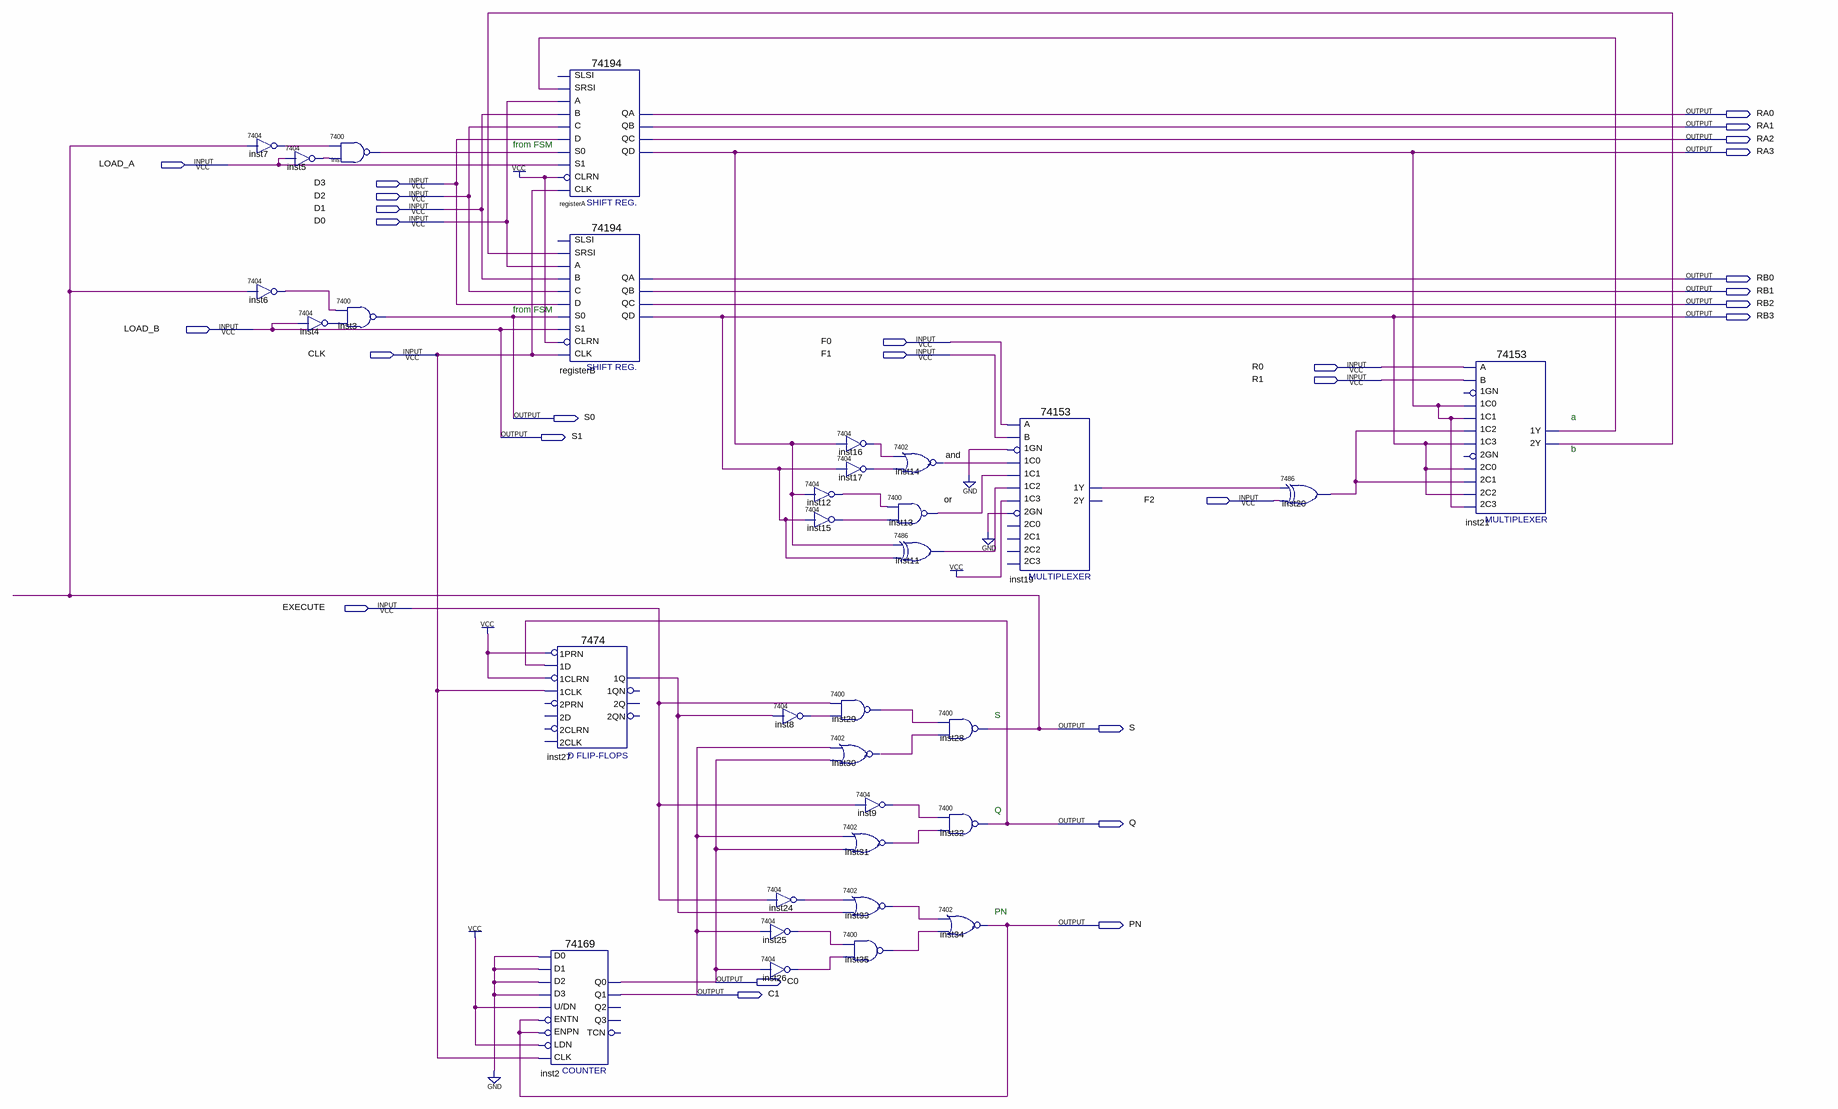
[diagram p0: schematic sheet]
// Quartus schematic lab3.bdf as structural Verilog: 33 symbols, 28 pins
module lab3 (
  input  LOAD_A,
  input  D3,
  input  D2,
  input  D1,
  input  D0,
  input  LOAD_B,
  input  F0,
  input  CLK,
  input  F1,
  input  R0,
  input  R1,
  input  F2,
  input  EXECUTE,
  output RA0,
  output RA1,
  output RA2,
  output RA3,
  output RB0,
  output RB1,
  output RB2,
  output RB3,
  output S0,
  output S1,
  output S,
  output Q,
  output PN,
  output C0,
  output C1
);

  wire \and , inst4_1, inst5_1, inst6_1, inst7_1, inst8_1, inst9_1, inst11_1, inst12_1, inst15_1, inst16_1,
       inst17_1, inst19_1y, inst20_1, inst21_1y, inst21_2y, inst24_1, inst25_1, inst26_1, inst27_1q,
       inst29_1, inst30_1, inst31_1, inst33_1, inst35_1, inst_1, \or ;

  \7404  inst7 (.\2 (S), .\1 (inst7_1));
  \7404  inst6 (.\2 (S), .\1 (inst6_1));
  \7404  inst5 (.\2 (LOAD_A), .\1 (inst5_1));
  \7404  inst4 (.\2 (LOAD_B), .\1 (inst4_1));
  \7400  inst (.\3 (inst5_1), .\2 (inst7_1), .\1 (inst_1));
  \7400  inst3 (.\3 (inst4_1), .\2 (inst6_1), .\1 (S0));
  \74194  registerA (
    .SRSI(inst21_1y), .B(D1), .C(D2), .CLK(CLK), .CLRN(1'b1), .D(D3), .S1(LOAD_A), .S0(inst_1), .A(D0),
    .QA(RA0), .QB(RA1), .QC(RA2), .QD(RA3));  // open: SLSI
  \74194  registerB (
    .SRSI(inst21_2y), .B(D1), .C(D2), .CLK(CLK), .CLRN(1'b1), .D(D3), .S1(LOAD_B), .S0(S0), .A(D0), .QA(RB0),
    .QB(RB1), .QC(RB2), .QD(RB3));  // open: SLSI
  \7474  inst27 (
    .\1CLK (CLK), .\1D (Q), .\1PRN (1'b1), .\1CLRN (1'b1), .\1Q (inst27_1q));  // open: 2D, 2PRN, 2CLK, 2CLRN, 1QN, 2Q, 2QN
  \74169  inst2 (
    .D1(1'b0), .D2(1'b0), .D0(1'b0), .ENTN(PN), .\U/DN (1'b1), .D3(1'b0), .LDN(1'b1), .CLK(CLK), .ENPN(PN),
    .Q1(C1), .Q0(C0));  // open: Q2, TCN, Q3
  \7404  inst24 (.\2 (EXECUTE), .\1 (inst24_1));
  \7404  inst25 (.\2 (C1), .\1 (inst25_1));
  \7404  inst26 (.\2 (C0), .\1 (inst26_1));
  \7404  inst12 (.\2 (RA3), .\1 (inst12_1));
  \7404  inst15 (.\2 (RB3), .\1 (inst15_1));
  \7404  inst8 (.\2 (inst27_1q), .\1 (inst8_1));
  \7404  inst16 (.\2 (RA3), .\1 (inst16_1));
  \7404  inst17 (.\2 (RB3), .\1 (inst17_1));
  \7400  inst29 (.\3 (inst8_1), .\2 (EXECUTE), .\1 (inst29_1));
  \7402  inst30 (.\2 (C1), .\3 (C0), .\1 (inst30_1));
  \7404  inst9 (.\2 (EXECUTE), .\1 (inst9_1));
  \7402  inst31 (.\2 (C1), .\3 (C0), .\1 (inst31_1));
  \7402  inst33 (.\2 (inst24_1), .\3 (inst27_1q), .\1 (inst33_1));
  \7400  inst35 (.\3 (inst26_1), .\2 (inst25_1), .\1 (inst35_1));
  \7402  inst14 (.\2 (inst16_1), .\3 (inst17_1), .\1 (\and ));
  \7400  inst13 (.\3 (inst15_1), .\2 (inst12_1), .\1 (\or ));
  \7486  inst11 (.\2 (RA3), .\3 (RB3), .\1 (inst11_1));
  \7400  inst28 (.\3 (inst30_1), .\2 (inst29_1), .\1 (S));
  \7400  inst32 (.\3 (inst31_1), .\2 (inst9_1), .\1 (Q));
  \7402  inst34 (.\2 (inst33_1), .\3 (inst35_1), .\1 (PN));
  \74153  inst19 (
    .\1C1 (\or ), .\1GN (1'b0), .\1C0 (\and ), .\2GN (1'b0), .\1C2 (inst11_1), .\1C3 (1'b1), .B(F1), .A(F0),
    .\1Y (inst19_1y));  // open: 2C0, 2C2, 2C1, 2C3, 2Y
  \7486  inst20 (.\2 (inst19_1y), .\3 (F2), .\1 (inst20_1));
  \74153  inst21 (
    .\1C1 (RA3), .\1C0 (RA3), .\2C0 (RB3), .\2C2 (RB3), .\1C2 (inst20_1), .\1C3 (RB3), .B(R1), .A(R0),
    .\2C1 (inst20_1), .\2C3 (RA3), .\1Y (inst21_1y), .\2Y (inst21_2y));  // open: 1GN, 2GN

  assign S1 = LOAD_B;

  // Notes on the sheet:
  //   from FSM
  //   from FSM
  //   a
  //   b
  //   S
  //   Q
  //   PN
endmodule
